# Altium schematic sheet BUCK.SchDoc
size A3; SheetNumber: 20; SheetTotal: 35
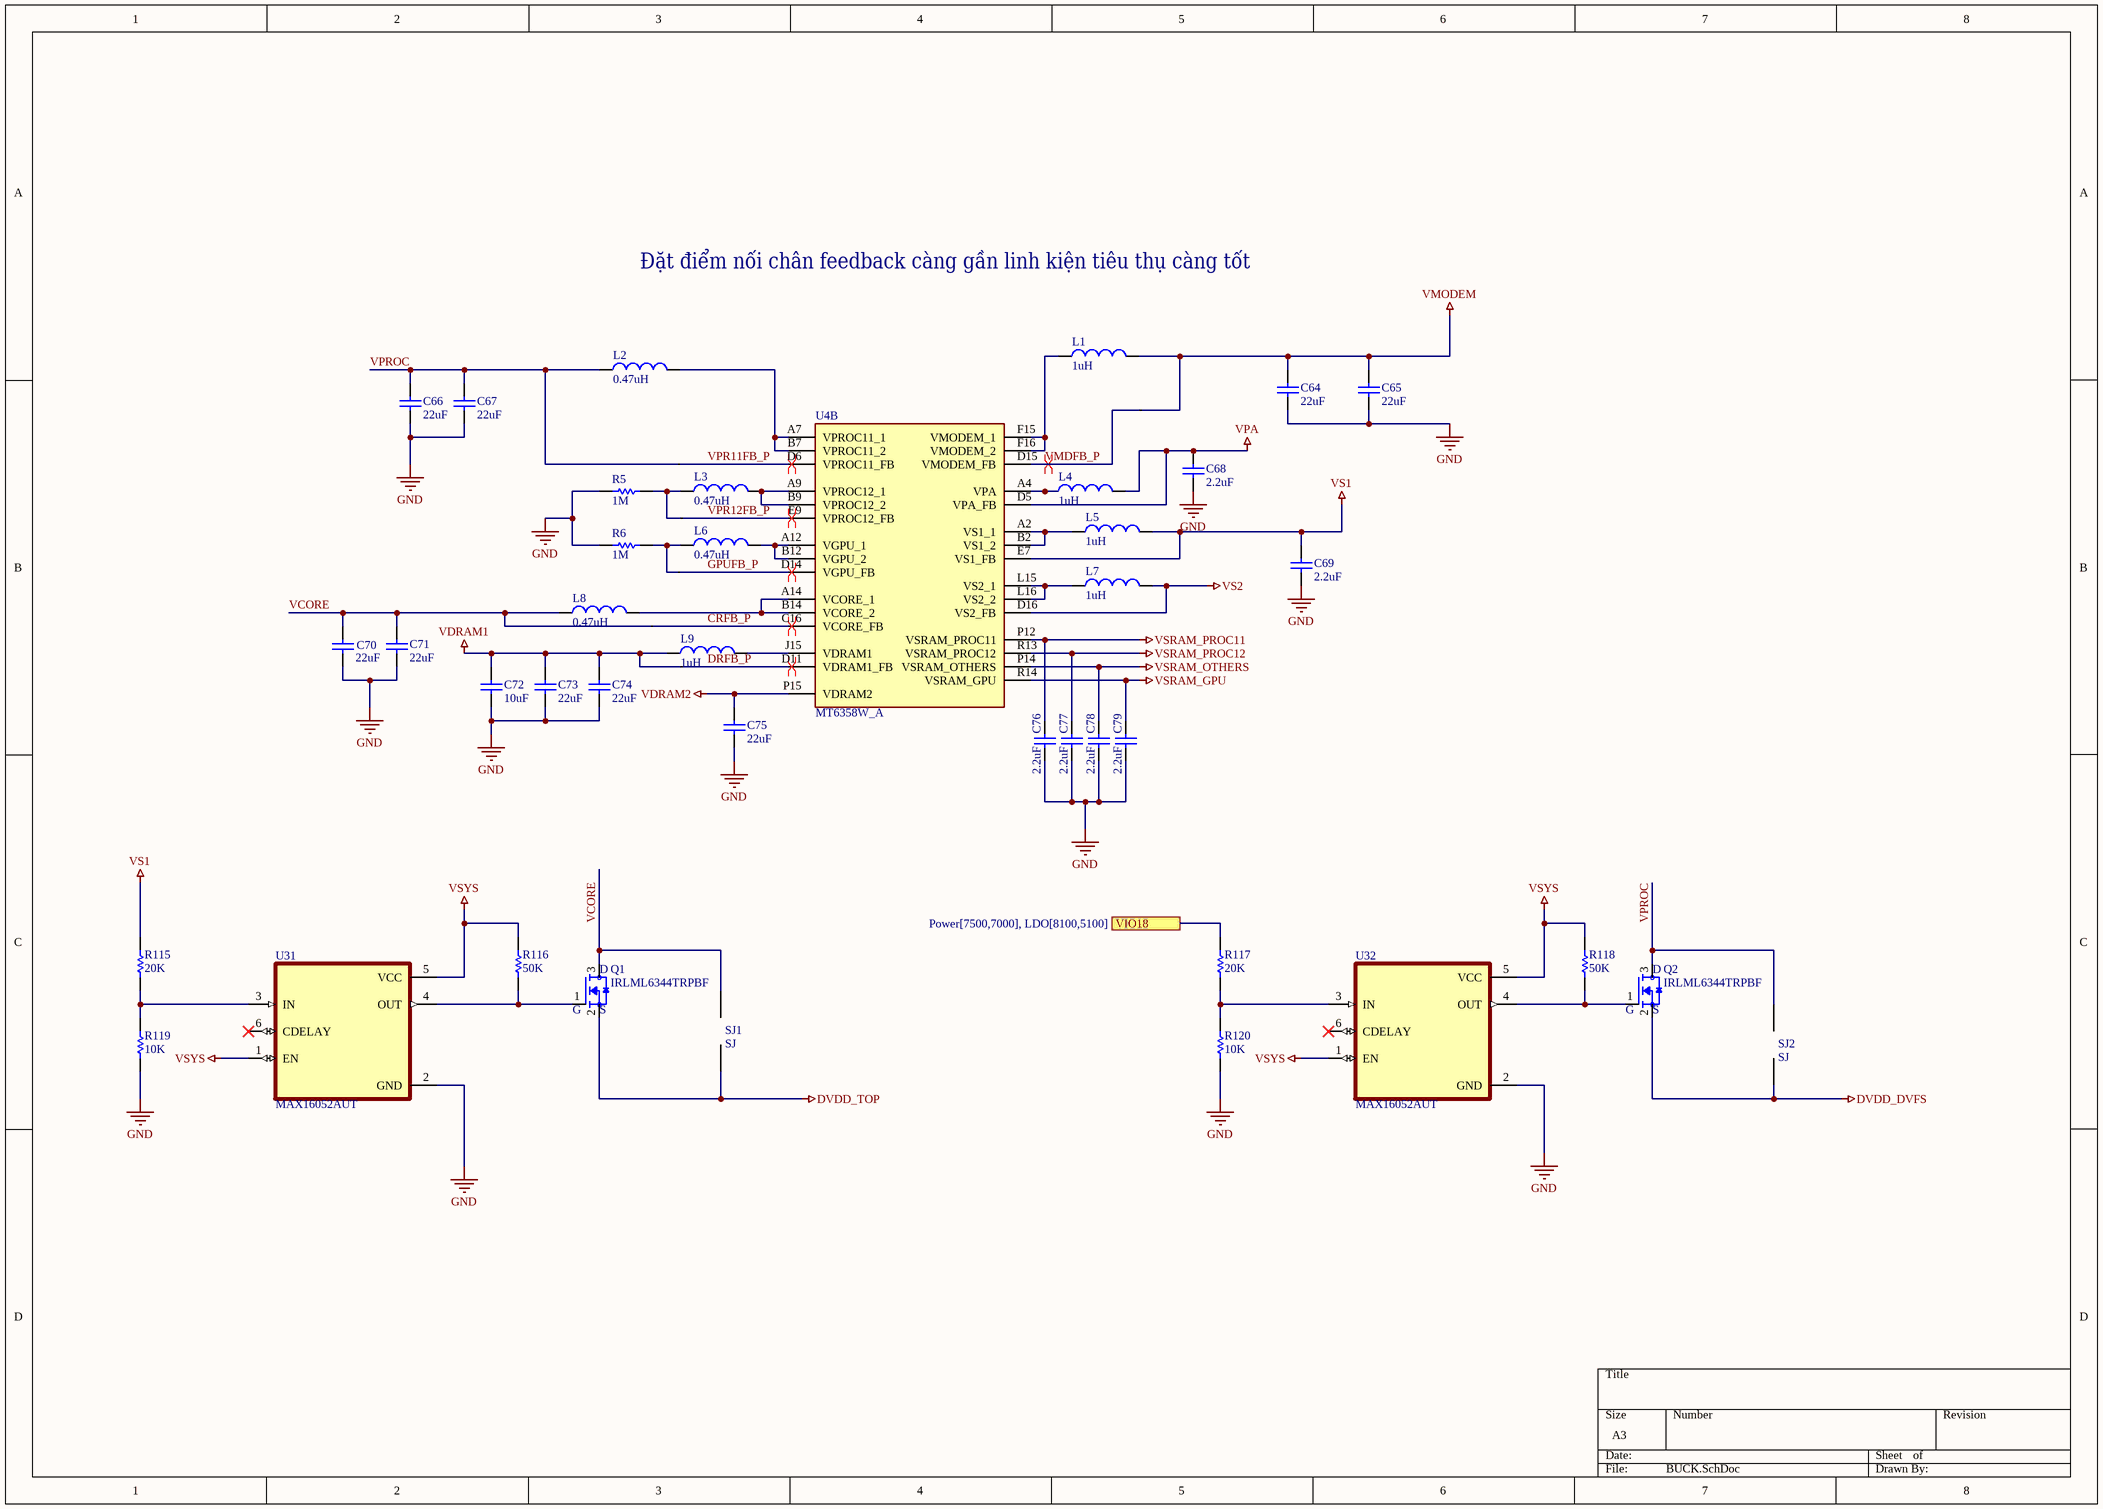
[diagram p0: BUCK.SchDoc]

## Parts
.6  P  [P]  (value not drawn)
.7  P  [P]  (value not drawn)
.9  P  [P]  (value not drawn)
.11  P  [P]  (value not drawn)
.13  P  [P]  (value not drawn)
.14  P  [P]  (value not drawn)
C64  value 22uF  [C1210]  (hidden comment: C1210)
C65  value 22uF  [C1210]  (hidden comment: C1210)
C66  value 22uF  [C1210]  (hidden comment: C1210)
C67  value 22uF  [C1210]  (hidden comment: C1210)
C68  value 2.2uF  [C0805]  (hidden comment: C0805)
C69  value 2.2uF  [C0805]  (hidden comment: C0805)
C70  value 22uF  [C1210]  (hidden comment: C1210)
C71  value 22uF  [C1210]  (hidden comment: C1210)
C72  value 10uF  [C1210]  (hidden comment: C1210)
C73  value 22uF  [C1210]  (hidden comment: C1210)
C74  value 22uF  [C1210]  (hidden comment: C1210)
C75  value 22uF  [C1210]  (hidden comment: C1210)
C76  value 2.2uF  [C0805]  (hidden comment: C0805)
C77  value 2.2uF  [C0805]  (hidden comment: C0805)
C78  value 2.2uF  [C0805]  (hidden comment: C0805)
C79  value 2.2uF  [C0805]  (hidden comment: C0805)
L1  value 1uH  [L0806]  (hidden comment: L0806)
L2  value 0.47uH  [L0806]  (hidden comment: L0806)
L3  value 0.47uH  [L0806]  (hidden comment: L0806)
L4  value 1uH  [L0806]  (hidden comment: L0806)
L5  value 1uH  [L0806]  (hidden comment: L0806)
L6  value 0.47uH  [L0806]  (hidden comment: L0806)
L7  value 1uH  [L0806]  (hidden comment: L0806)
L8  value 0.47uH  [L0806]  (hidden comment: L0806)
L9  value 1uH  [L0806]  (hidden comment: L0806)
Q1  IRLML6344TRPBF  [SOT95P240X112-3N]
Q2  IRLML6344TRPBF  [SOT95P240X112-3N]
R5  value 1M  [R0603]  (hidden comment: R0603)
R6  value 1M  [R0603]  (hidden comment: R0603)
R115  value 20K  [R0603]  (hidden comment: R0603)
R116  value 50K  [R0603]  (hidden comment: R0603)
R117  value 20K  [R0603]  (hidden comment: R0603)
R118  value 50K  [R0603]  (hidden comment: R0603)
R119  value 10K  [R0603]  (hidden comment: R0603)
R120  value 10K  [R0603]  (hidden comment: R0603)
SJ1  SJ  [SJ2]
SJ2  SJ  [SJ2]
U4  MT6358W_A  [BGA194C40P16X15_640X600X66]  (part B of 6)
U31  MAX16052AUT  [SOT95P280X145-6N]
U32  MAX16052AUT  [SOT95P280X145-6N]

## Ports
VIO18 (see Power[7500,7000], LDO[8100,5100])

## Nets
DVDD_DVFS: Q2.2(S) SJ2.1
DVDD_TOP: Q1.2(S) SJ1.1
GND: C64.1 C65.1 C66.1 C67.1 C68.1 C69.1 C70.1 C71.1 C72.1 C73.1 C74.1 C75.1 C76.1 C77.1 C78.1 C79.1 R5.1 R6.1 R119.1 R120.1 U31.2(GND) U32.2(GND)
VDRAM1: .14.1 C72.2 C73.2 C74.2 L9.1
VDRAM2: C75.2 U4.P15(VDRAM2)
VMODEM: .6.2 C64.2 C65.2 L1.2
VPA: C68.2 L4.2 U4.D5(VPA_FB)
VS1: C69.2 L5.2 R115.2 U4.E7(VS1_FB)
VS2: L7.2 U4.D16(VS2_FB)
VSRAM_GPU: C79.2 U4.R14(VSRAM_GPU)
VSRAM_OTHERS: C78.2 U4.P14(VSRAM_OTHERS)
VSRAM_PROC11: C76.2 U4.P12(VSRAM_PROC11)
VSRAM_PROC12: C77.2 U4.R13(VSRAM_PROC12)
VSYS: R116.2 R118.2 U31.1(EN) U31.5(VCC) U32.1(EN) U32.5(VCC)
CRFB_P: .13.2 U4.C16(VCORE_FB)
DRFB_P: .14.2 U4.D11(VDRAM1_FB)
GPUFB_P: .11.2 U4.D14(VGPU_FB)
VCORE: .13.1 C70.2 C71.2 L8.1 Q1.3(D) SJ1.2
VIO18: R117.2 ; port VIO18
VMDFB_P: .6.1 U4.D15(VMODEM_FB)
VPR11FB_P: .7.2 U4.D6(VPROC11_FB)
VPR12FB_P: .9.2 U4.E9(VPROC12_FB)
VPROC: .7.1 C66.2 C67.2 L2.1 Q2.3(D) SJ2.2
Net.9_1: .9.1 L3.1 R5.2
Net.11_1: .11.1 L6.1 R6.2
NetL1_1: L1.1 U4.F15(VMODEM_1) U4.F16(VMODEM_2)
NetL2_2: L2.2 U4.A7(VPROC11_1) U4.B7(VPROC11_2)
NetL3_2: L3.2 U4.A9(VPROC12_1) U4.B9(VPROC12_2)
NetL4_1: L4.1 U4.A4(VPA)
NetL5_1: L5.1 U4.A2(VS1_1) U4.B2(VS1_2)
NetL6_2: L6.2 U4.A12(VGPU_1) U4.B12(VGPU_2)
NetL7_1: L7.1 U4.L15(VS2_1) U4.L16(VS2_2)
NetL8_2: L8.2 U4.A14(VCORE_1) U4.B14(VCORE_2)
NetL9_2: L9.2 U4.J15(VDRAM1)
NetQ1_1: Q1.1(G) R116.1 U31.4(OUT)
NetQ2_1: Q2.1(G) R118.1 U32.4(OUT)
NetR115_1: R115.1 R119.2 U31.3(IN)
NetR117_1: R117.1 R120.2 U32.3(IN)

Not connected (* = marked no-connect by the designer): U31 6(CDELAY)*; U32 6(CDELAY)*

## Layout directives
differential pair: CRFB_P, DRFB_P, GPUFB_P, VMDFB_P, VPR11FB_P, VPR12FB_P

## Notes on the sheet
- Đặt điểm nối chân feedback càng gần linh kiện tiêu thụ càng tốt

## Library data of the parts
L1-L9 = L0806: Inductor / SMD:1.6x2mm
Q1 Q2 = IRLML6344TRPBF: IRLML6344TRPBF N-channel MOSFET Transistor, 5 A, 30 V, 3-Pin SOT-23 | Infineon IRLML6344TRPBF
SJ1 SJ2 = SJ: Để hở. hàn 2 đầu lại nếu cần
U4 = MT6358W_A: Integrated Circuit; Manufacturer_Name: Mediatek; Manufacturer_Part_Number: MT6358W/A; Datasheet Link: https://www.mouser.com/catalog/specsheets/MediaTek_MTK_MT6358_Product_Brief_v1_0.pdf?_gl=1*14yevt7*_ga*OTAyMjU2NDU3LjE2ODExMDUyMzk.*_ga_1KQLCYKRX3*MTcwODA1NjU3MS4xMTcuMC4xNzA4MDU2NTczLjAuMC4w*_ga_15W4STQT4T*MTcwODA1NjU3Mi4xNzIuMC4xNzA4MDU2NTczLjU5LjAuMA..; Height: 0.66mm; Mouser Part Number: 840-MT6358W/A; Mouser Price/Stock: https://www.mouser.co.uk/ProductDetail/MediaTek/MT6358W-A?qs=Jm2GQyTW%2FbiK3FZkyfX0lQ%3D%3D
U31 U32 = MAX16052AUT: High-Voltage, Adjustable Sequencing/Supervisory Circuitss